# Altium schematic sheet MCU.SchDoc
size A4; DocumentNumber: 1; SheetNumber: 2; SheetTotal: 3
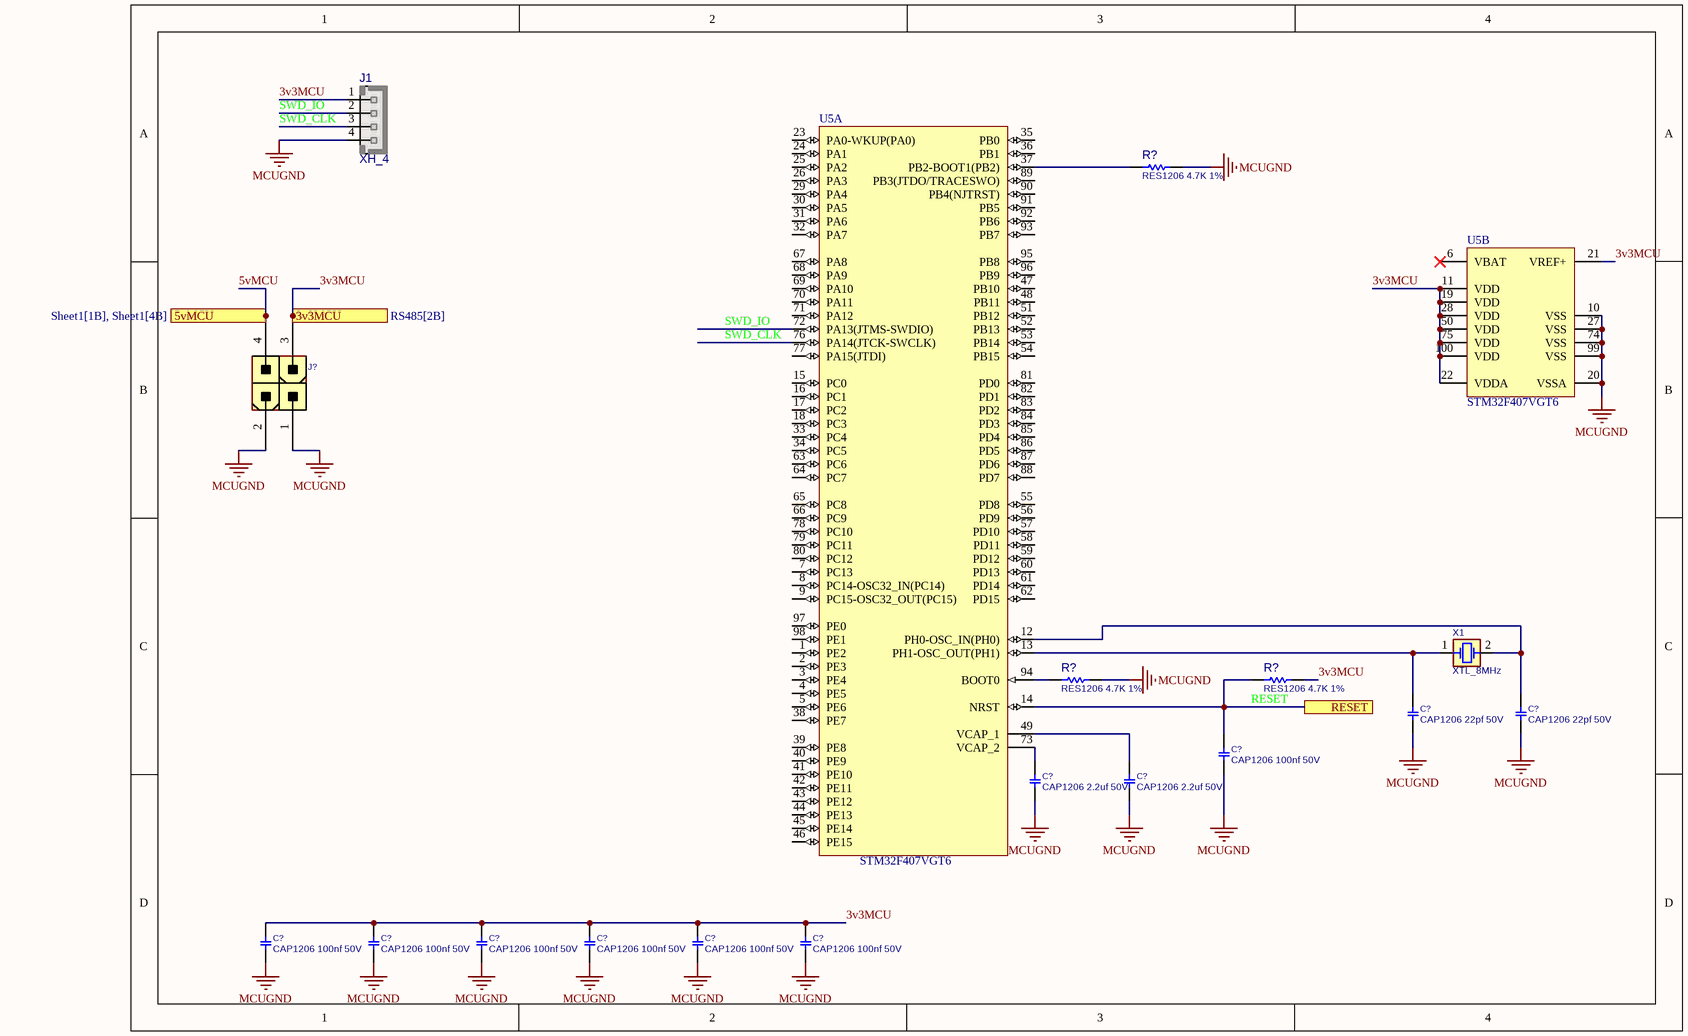
[diagram p0: MCU.SchDoc]

## Parts
(Parts that share a designator on the sheet are numbered #1, #2 ... from top to bottom, then left to right.)
C?#1  CAP1206 22pf 50V  [C1206]
C?#2  CAP1206 22pf 50V  [C1206]
C?#3  CAP1206 100nf 50V  [C1206]
C?#4  CAP1206 2.2uf 50V  [C1206]
C?#5  CAP1206 2.2uf 50V  [C1206]
C?#6  CAP1206 100nf 50V  [C1206]
C?#7  CAP1206 100nf 50V  [C1206]
C?#8  CAP1206 100nf 50V  [C1206]
C?#9  CAP1206 100nf 50V  [C1206]
C?#10  CAP1206 100nf 50V  [C1206]
C?#11  CAP1206 100nf 50V  [C1206]
J1  XH_4  [XH_4]
J?  CONN_ATXPWR_4  [ATXPWR_4]  (value not drawn)
R?#1  RES1206 4.7K 1%  [R1206]
R?#2  RES1206 4.7K 1%  [R1206]
R?#3  RES1206 4.7K 1%  [R1206]
U5  STM32F407VGT6  [STM-LQFP100_N]  (parts A,B of 2)
X1  XTL_8MHz  [XTL_2_11X5]

## Ports
3v3MCU (see RS485[2B]), 5vMCU (see Sheet1[1B], Sheet1[4B]), RESET

## Nets
MCUGND: C?#1.1 C?#2.1 C?#3.1 C?#4.1 C?#5.1 C?#6.1 C?#7.1 C?#8.1 C?#9.1 C?#10.1 C?#11.1 J1.4 J?.1 J?.2 R?#1.2 R?#2.2 U5.10(VSS) U5.20(VSSA) U5.27(VSS) U5.74(VSS) U5.99(VSS)
3v3MCU: C?#6.2 C?#7.2 C?#8.2 C?#9.2 C?#10.2 C?#11.2 J1.1 J?.3 R?#3.2 U5.11(VDD) U5.19(VDD) U5.21(VREF+) U5.22(VDDA) U5.28(VDD) U5.50(VDD) U5.75(VDD) U5.100(VDD) ; port 3v3MCU
5vMCU: J?.4 ; port 5vMCU
RESET: C?#3.2 R?#3.1 U5.14(NRST) ; port RESET
SWD_CLK: J1.3 U5.76(PA14(JTCK-SWCLK))
SWD_IO: J1.2 U5.72(PA13(JTMS-SWDIO))
NetC?#1_2: C?#1.2 U5.13(PH1-OSC_OUT(PH1)) X1.1(OSC1)
NetC?#2_2: C?#2.2 U5.12(PH0-OSC_IN(PH0)) X1.2(OSC2)
NetC?#4_2: C?#4.2 U5.73(VCAP_2)
NetC?#5_2: C?#5.2 U5.49(VCAP_1)
NetR?#1_1: R?#1.1 U5.37(PB2-BOOT1(PB2))
NetR?#2_1: R?#2.1 U5.94(BOOT0)

Not connected (* = marked no-connect by the designer): U5 1(PE2) 2(PE3) 3(PE4) 4(PE5) 5(PE6) 6(VBAT)* 7(PC13) 8(PC14-OSC32_IN(PC14)) 9(PC15-OSC32_OUT(PC15)) 15(PC0) 16(PC1) 17(PC2) 18(PC3) 23(PA0-WKUP(PA0)) 24(PA1) 25(PA2) 26(PA3) 29(PA4) 30(PA5) 31(PA6) 32(PA7) 33(PC4) 34(PC5) 35(PB0) 36(PB1) 38(PE7) 39(PE8) 40(PE9) 41(PE10) 42(PE11) 43(PE12) 44(PE13) 45(PE14) 46(PE15) 47(PB10) 48(PB11) 51(PB12) 52(PB13) 53(PB14) 54(PB15) 55(PD8) 56(PD9) 57(PD10) 58(PD11) 59(PD12) 60(PD13) 61(PD14) 62(PD15) 63(PC6) 64(PC7) 65(PC8) 66(PC9) 67(PA8) 68(PA9) 69(PA10) 70(PA11) 71(PA12) 77(PA15(JTDI)) 78(PC10) 79(PC11) 80(PC12) 81(PD0) 82(PD1) 83(PD2) 84(PD3) 85(PD4) 86(PD5) 87(PD6) 88(PD7) 89(PB3(JTDO/TRACESWO)) 90(PB4(NJTRST)) 91(PB5) 92(PB6) 93(PB7) 95(PB8) 96(PB9) 97(PE0) 98(PE1)

## Library data of the parts
C?#1-C?#11 = CAP_SMD_MLCC_1206: CAP, MLCC; PARAM: -, -%; MANF_P#: MANF_PART#; PARAM2: -V; PRICE: 100= 1$; MANF: -; ASSEMBLY: ASSEMBLY
J1 = XH_4: PW10-x-M, JST-BxB-XH-A pitch: 2.5mm, 3A/250v; MANF: JST; MANF_P#: B4B-XH-A; PARAM2: 250v; PARAM: 3.0A; VALUE: XH_4
J? = CONN_ATXPWR_4: CONN, ATX POWER, 4 P; MANF: TE, Molex; MANF_P#: 4-1775099-0, 39281043; VALUE: CONN_ATXPWR_4; MountType: THD; PACKAGE: ATXPWR-4pin; Part Type: Conn.
R?#1-R?#3 = RES_SMD_1206: RESISTOR, SMD; PARAM: 1%, 0.25W; DESC: DESCRIPTION; DIST#: MOUSER; MANF_P#: -; MANF: -; ASSEMBLY: ASSEMBLY; PRICE: -; PARAM2: -
U5 = STM32F407VGT6: ARM Cortex-M4 32-bit MCU+FPU, 210 DMIPS, 1024 kB Flash, 192 kB Internal RAM, 82 I/Os, 100-pin LQFP, -40 to 85 degC, Tray; Manufacturer: STMicroelectronics; D/A Converter: 2x12-bit; FLASH Size (Prog) (kB): 1024; I/Os (High Current): 82; Internal RAM Size (kB): 192; Operating Frequency(F) (Processor speed) (MHz): 168; Supply Voltage(Vcc) max (V): 3.6; Supply Voltage(Vcc) min (V): 1.8; DatasheetVersion: Rev. 4; PackageVersion: Rev. 1, 06/2013; PackageReference: LQFP100; PackageDescription: 100-Pin Low Profile Quad Flat Package, 14 x 14 mm Body, 0.5 mm Pitch; Supplier 1: Digi-Key; Supplier Part Number 1: 497-11605-ND; Supplier 2: Farnell; Supplier Part Number 2: 2064368; Supplier 3: Newark; Supplier Part Number 3: 73T2333; Supplier 4: Mouser; Supplier Part Number 4: 511-STM32F407VGT6; Core: ARM Cortex-M4; Packing: Tray; Mounting Technology: Surface Mount; PartNumber: STM32F407VGT6; ComponentLink1Description: Manufacturer URL; ComponentLink1URL: http://www.st.com/web/en/home.html; ComponentLink2Description: Datasheet; ComponentLink2URL: http://www.st.com/st-web-ui/static/active/en/resource/technical/document/datasheet/DM00037051.pdf; ComponentLink3Description: Package Specification; ComponentLink3URL: http://www.st.com/st-web-ui/static/active/en/resource/technical/document/data_brief/DM00071938.pdf
X1 = XTL_2_HC49_8MHz_SMD: Crystal MOST POPULAR ABL HC49 PACKAGE; MANF: ABRACON; MANF_P#: ABLS-8.000MHZ-B4-T; PARAM: 8MHz, 18pF, 30PPM, -20~70oC; PRICE: 0.3$; VALUE: XTL_8MHz